# EAGLE design ADDER (EAGLE 9.6.2)
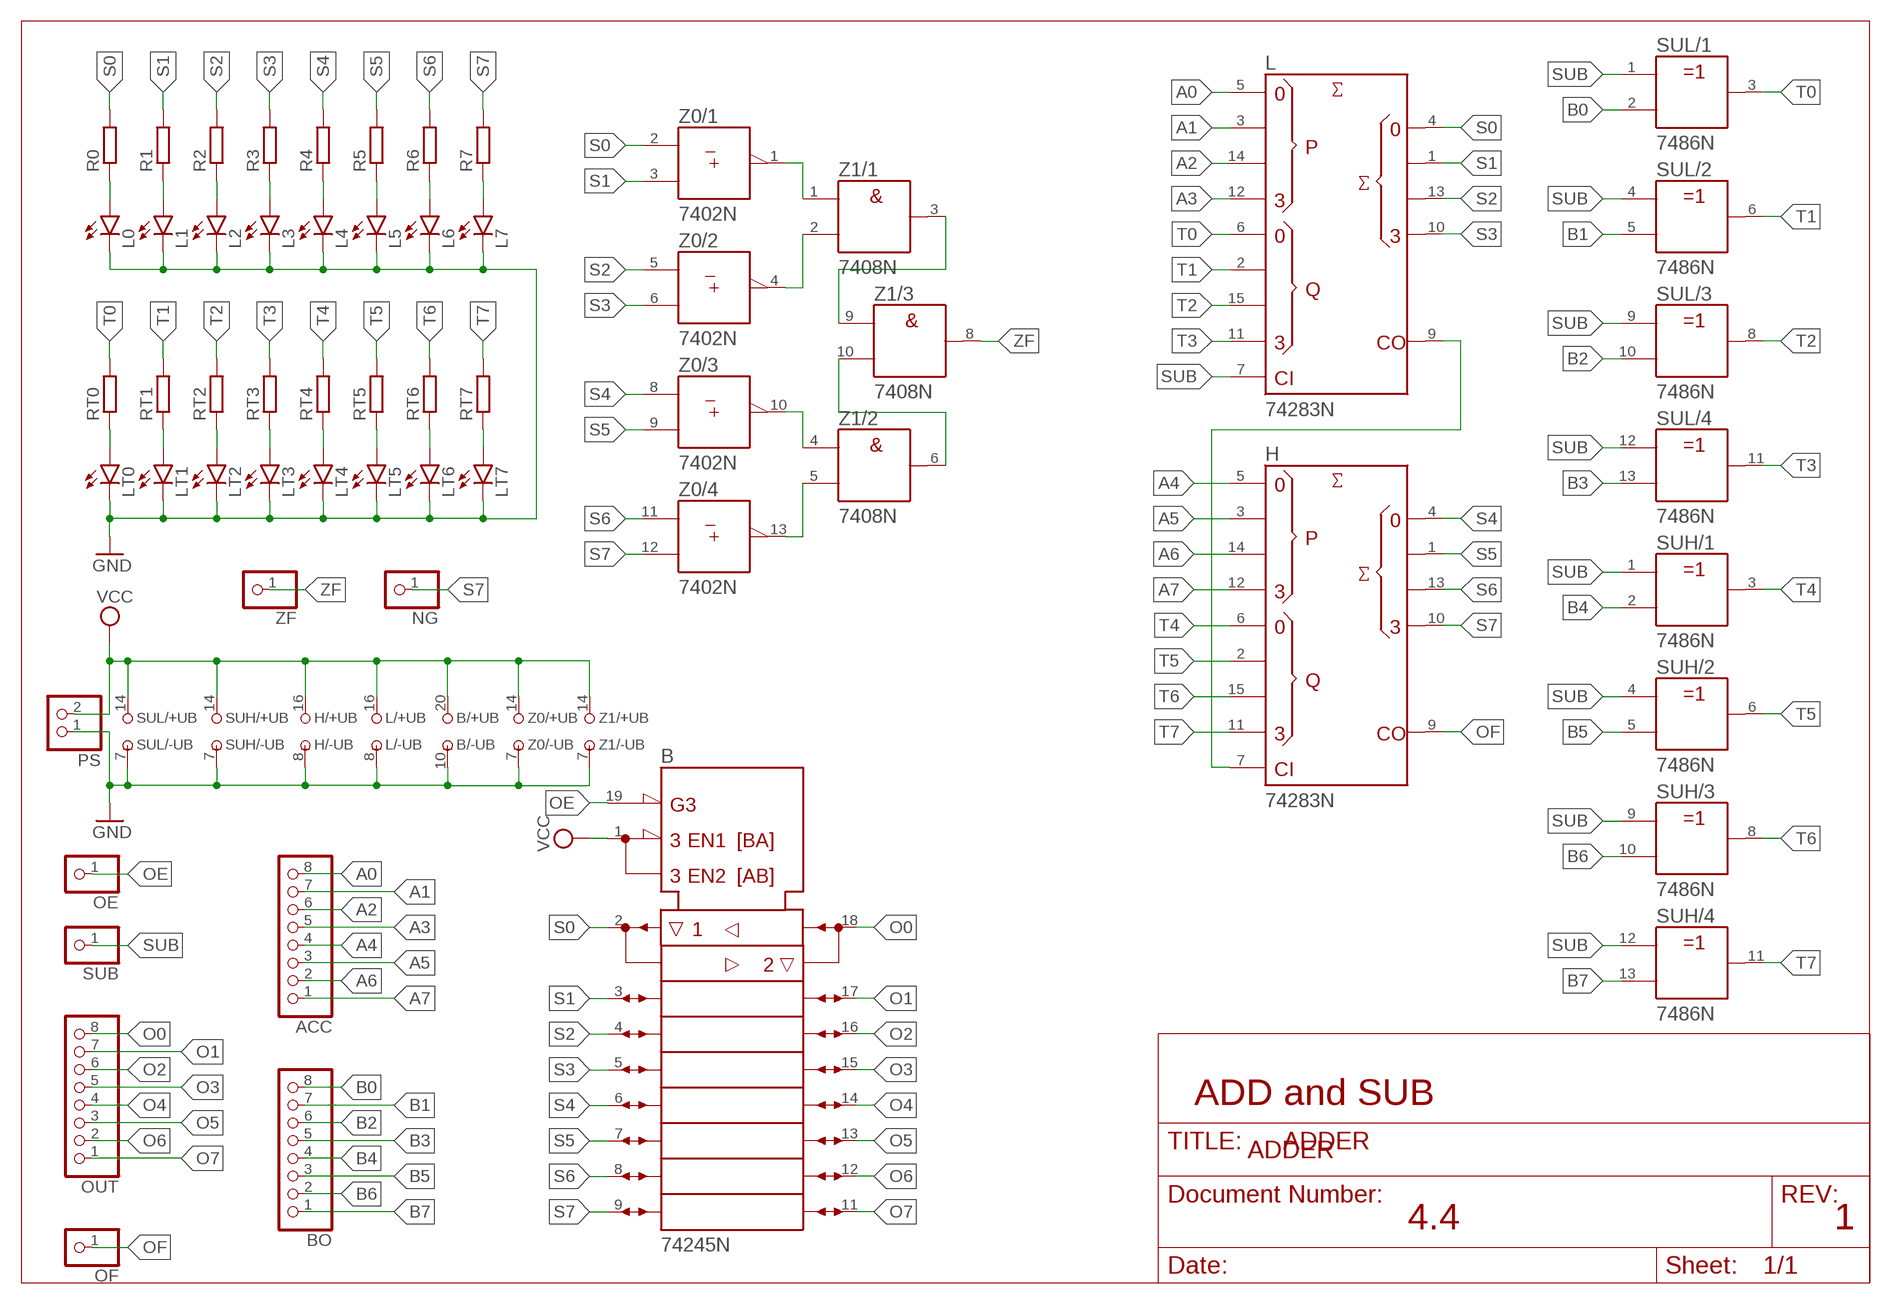
[diagram p0: schematic, sheet 1]

## Parts
ACC  PINHD-1X8  [1X08]
B  74245N  [DIL20]
BO  PINHD-1X8  [1X08]
H  74283N  [DIL16]
L  74283N  [DIL16]
L0  LED5MM  [LED5MM]
L1  LED5MM  [LED5MM]
L2  LED5MM  [LED5MM]
L3  LED5MM  [LED5MM]
L4  LED5MM  [LED5MM]
L5  LED5MM  [LED5MM]
L6  LED5MM  [LED5MM]
L7  LED5MM  [LED5MM]
LT0  LED5MM  [LED5MM]
LT1  LED5MM  [LED5MM]
LT2  LED5MM  [LED5MM]
LT3  LED5MM  [LED5MM]
LT4  LED5MM  [LED5MM]
LT5  LED5MM  [LED5MM]
LT6  LED5MM  [LED5MM]
LT7  LED5MM  [LED5MM]
NG  PINHD-1X1  [1X01]
OE  PINHD-1X1  [1X01]
OF  PINHD-1X1  [1X01]
OUT  PINHD-1X8  [1X08]
PS  PINHD-1X2  [1X02]
R0  R-EU_0204/7  [0204/7]
R1  R-EU_0204/7  [0204/7]
R2  R-EU_0204/7  [0204/7]
R3  R-EU_0204/7  [0204/7]
R4  R-EU_0204/7  [0204/7]
R5  R-EU_0204/7  [0204/7]
R6  R-EU_0204/7  [0204/7]
R7  R-EU_0204/7  [0204/7]
RT0  R-EU_0204/7  [0204/7]
RT1  R-EU_0204/7  [0204/7]
RT2  R-EU_0204/7  [0204/7]
RT3  R-EU_0204/7  [0204/7]
RT4  R-EU_0204/7  [0204/7]
RT5  R-EU_0204/7  [0204/7]
RT6  R-EU_0204/7  [0204/7]
RT7  R-EU_0204/7  [0204/7]
SUB  PINHD-1X1  [1X01]
SUH  7486N  [DIL14]
SUL  7486N  [DIL14]
Z0  7402N  [DIL14]
Z1  7408N  [DIL14]
ZF  PINHD-1X1  [1X01]

## Nets
A0: ACC.8 L.5(A1)
A1: ACC.7 L.3(A2)
A2: ACC.6 L.14(A3)
A3: ACC.5 L.12(A4)
A4: ACC.4 H.5(A1)
A5: ACC.3 H.3(A2)
A6: ACC.2 H.14(A3)
A7: ACC.1 H.12(A4)
B0: BO.8 SUL.2(/1:B)
B1: BO.7 SUL.5(/2:B)
B2: BO.6 SUL.10(/3:B)
B3: BO.5 SUL.13(/4:B)
B4: BO.4 SUH.2(/1:B)
B5: BO.3 SUH.5(/2:B)
B6: BO.2 SUH.10(/3:B)
B7: BO.1 SUH.13(/4:B)
GND: B.10(-UB) H.8(-UB) L0.K(C) L1.K(C) L2.K(C) L3.K(C) L4.K(C) L5.K(C) L6.K(C) L7.K(C) L.8(-UB) LT0.K(C) LT1.K(C) LT2.K(C) LT3.K(C) LT4.K(C) LT5.K(C) LT6.K(C) LT7.K(C) PS.1 SUH.7(/-UB:-UB) SUL.7(/-UB:-UB) Z0.7(/-UB:-UB) Z1.7(/-UB:-UB)
N$1: H.7(C0) L.9(C4)
N$2: L0.A R0.1
N$5: L1.A R1.1
N$7: L2.A R2.1
N$9: L3.A R3.1
N$11: L4.A R4.1
N$13: L5.A R5.1
N$15: L6.A R6.1
N$17: L7.A R7.1
N$18: Z0.13(/4:Y) Z1.5(/2:B)
N$19: LT0.A RT0.1
N$20: Z0.10(/3:Y) Z1.4(/2:A)
N$21: LT1.A RT1.1
N$22: Z1.6(/2:Y) Z1.10(/3:B)
N$23: LT2.A RT2.1
N$25: LT3.A RT3.1
N$26: Z1.3(/1:Y) Z1.9(/3:A)
N$27: LT4.A RT4.1
N$28: Z0.4(/2:Y) Z1.2(/1:B)
N$29: LT5.A RT5.1
N$30: Z0.1(/1:Y) Z1.1(/1:A)
N$31: LT6.A RT6.1
N$33: LT7.A RT7.1
O0: B.18(B1) OUT.8
O1: B.17(B2) OUT.7
O2: B.16(B3) OUT.6
O3: B.15(B4) OUT.5
O4: B.14(B5) OUT.4
O5: B.13(B6) OUT.3
O6: B.12(B7) OUT.2
O7: B.11(B8) OUT.1
OE: B.19(!G) OE.1
OF: H.9(C4) OF.1
S0: B.2(A1) L.4(S1) R0.2 Z0.2(/1:A)
S1: B.3(A2) L.1(S2) R1.2 Z0.3(/1:B)
S2: B.4(A3) L.13(S3) R2.2 Z0.5(/2:A)
S3: B.5(A4) L.10(S4) R3.2 Z0.6(/2:B)
S4: B.6(A5) H.4(S1) R4.2 Z0.8(/3:A)
S5: B.7(A6) H.1(S2) R5.2 Z0.9(/3:B)
S6: B.8(A7) H.13(S3) R6.2 Z0.11(/4:A)
S7: B.9(A8) H.10(S4) NG.1 R7.2 Z0.12(/4:B)
SUB: L.7(C0) SUB.1 SUH.1(/1:A) SUH.4(/2:A) SUH.9(/3:A) SUH.12(/4:A) SUL.1(/1:A) SUL.4(/2:A) SUL.9(/3:A) SUL.12(/4:A)
T0: L.6(B1) RT0.2 SUL.3(/1:Y)
T1: L.2(B2) RT1.2 SUL.6(/2:Y)
T2: L.15(B3) RT2.2 SUL.8(/3:Y)
T3: L.11(B4) RT3.2 SUL.11(/4:Y)
T4: H.6(B1) RT4.2 SUH.3(/1:Y)
T5: H.2(B2) RT5.2 SUH.6(/2:Y)
T6: H.15(B3) RT6.2 SUH.8(/3:Y)
T7: H.11(B4) RT7.2 SUH.11(/4:Y)
VCC: B.1(DIR) B.20(+UB) H.16(+UB) L.16(+UB) PS.2 SUH.14(/+UB:+UB) SUL.14(/+UB:+UB) Z0.14(/+UB:+UB) Z1.14(/+UB:+UB)
ZF: Z1.8(/3:Y) ZF.1
Unconnected: Z1.11(/4:Y) Z1.12(/4:A) Z1.13(/4:B)

## Notes on the sheet
- ADD and SUB
- ADDER
- 4.4 | 1

## Library data of the parts
ACC BO OUT = pinhead:PINHD-1X8: PIN HEADER
B = 74ttl-din:74*245: Octal BUS TRANSCEIVER, 3-state
H L = 74ttl-din:74*283: 4-bit binary FULL ADDER, fast carry
L0 L1-L7 LT0 LT1-LT7 = led:LED: LED OSRAM: - CHIPLED LG R971, LG N971, LY N971, LG Q971, LY Q971, LO R971, LY R971 LH N974, LH R974 LS Q976, LO Q976, LY Q976 LO Q996 - Hyper CHIPLED LW Q18S LB Q993, LB Q99A, LB R99A - SideLED LS A670, LO A670, LY A670, LG A670, LP A670 LB A673, LV A673, LT A673, LW A673 LH A674 LY A675 LS A676, LA A676, LO A676, LY A676, LW A676 LS A679, LY A679, LG A679 - Hyper Micro SIDELED® LS Y876, LA Y876, LO Y876, LY Y876 LT Y87S - SmartLED LW L88C, LW L88S LB L89C, LB L89S, LG L890 LS L89K, LO L89K, LY L89K LS L896, LA L896, LO L896, LY L896 - TOPLED LS T670, LO T670, LY T670, LG T670, LP T670 LSG T670, LSP T670, LSY T670, LOP T670, LYG T670 LG T671, LOG T671, LSG T671 LB T673, LV T673, LT T673, LW T673 LH T674 LS T676, LA T676, LO T676, LY T676, LB T676, LH T676, LSB T676, LW T676 LB T67C, LV T67C, LT T67C, LS T67K, LO T67K, LY T67K, LW E67C LS E67B, LA E67B, LO E67B, LY E67B, LB E67C, LV E67C, LT E67C LW T67C LS T679, LY T679, LG T679 LS T770, LO T770, LY T770, LG T770, LP T770 LB T773, LV T773, LT T773, LW T773 LH T774 LS E675, LA E675, LY E675, LS T675 LS T776, LA T776, LO T776, LY T776, LB T776 LHGB T686 LT T68C, LB T68C - Hyper Mini TOPLED® LB M676 - Mini TOPLED Santana® LG M470 LS M47K, LO M47K, LY M47K Source: http://www.osram.convergy.de LUXEON: - LUMILED® LXK2-PW12-R00, LXK2-PW12-S00, LXK2-PW14-U00, LXK2-PW14-V00 LXK2-PM12-R00, LXK2-PM12-S00, LXK2-PM14-U00 LXK2-PE12-Q00, LXK2-PE12-R00, LXK2-PE12-S00, LXK2-PE14-T00, LXK2-PE14-U00 LXK2-PB12-K00, LXK2-PB12-L00, LXK2-PB12-M00, LXK2-PB14-N00, LXK2-PB14-P00, LXK2-PB14-Q00 LXK2-PR12-L00, LXK2-PR12-M00, LXK2-PR14-Q00, LXK2-PR14-R00 LXK2-PD12-Q00, LXK2-PD12-R00, LXK2-PD12-S00 LXK2-PH12-R00, LXK2-PH12-S00 LXK2-PL12-P00, LXK2-PL12-Q00, LXK2-PL12-R00 Source: www.luxeon.com KINGBRIGHT: KA-3528ASYC Source: www.kingbright.com
NG OE OF SUB ZF = pinhead:PINHD-1X1: PIN HEADER
PS = pinhead:PINHD-1X2: PIN HEADER
R0 R1-R7 RT0 RT1-RT7 = rcl:R-EU_: RESISTOR, European symbol; SPICEPREFIX: R
SUH SUL = 74ttl-din:74*86: Quad 2-input EXCLUSIV-OR gate
Z0 = 74ttl-din:74*02: Quad 2-input NOR gate
Z1 = 74ttl-din:74*08: Quad 2-input AND gate

## Board
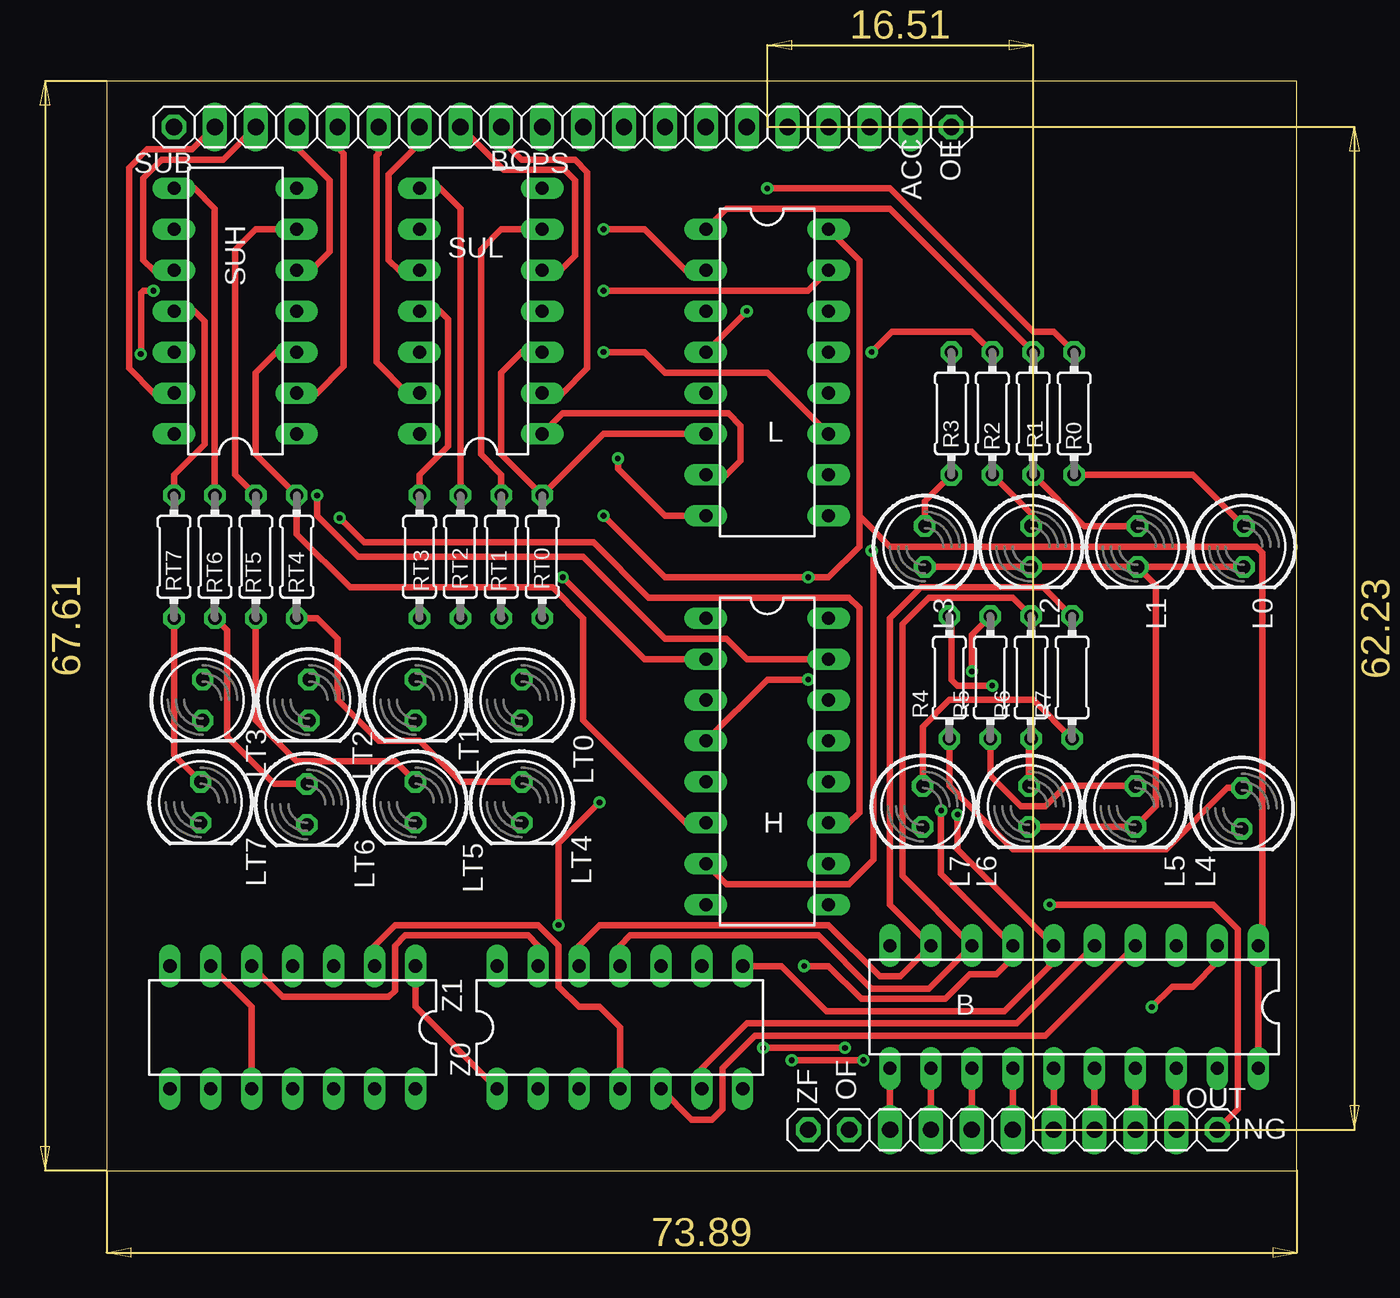
[diagram p1: board, top side]
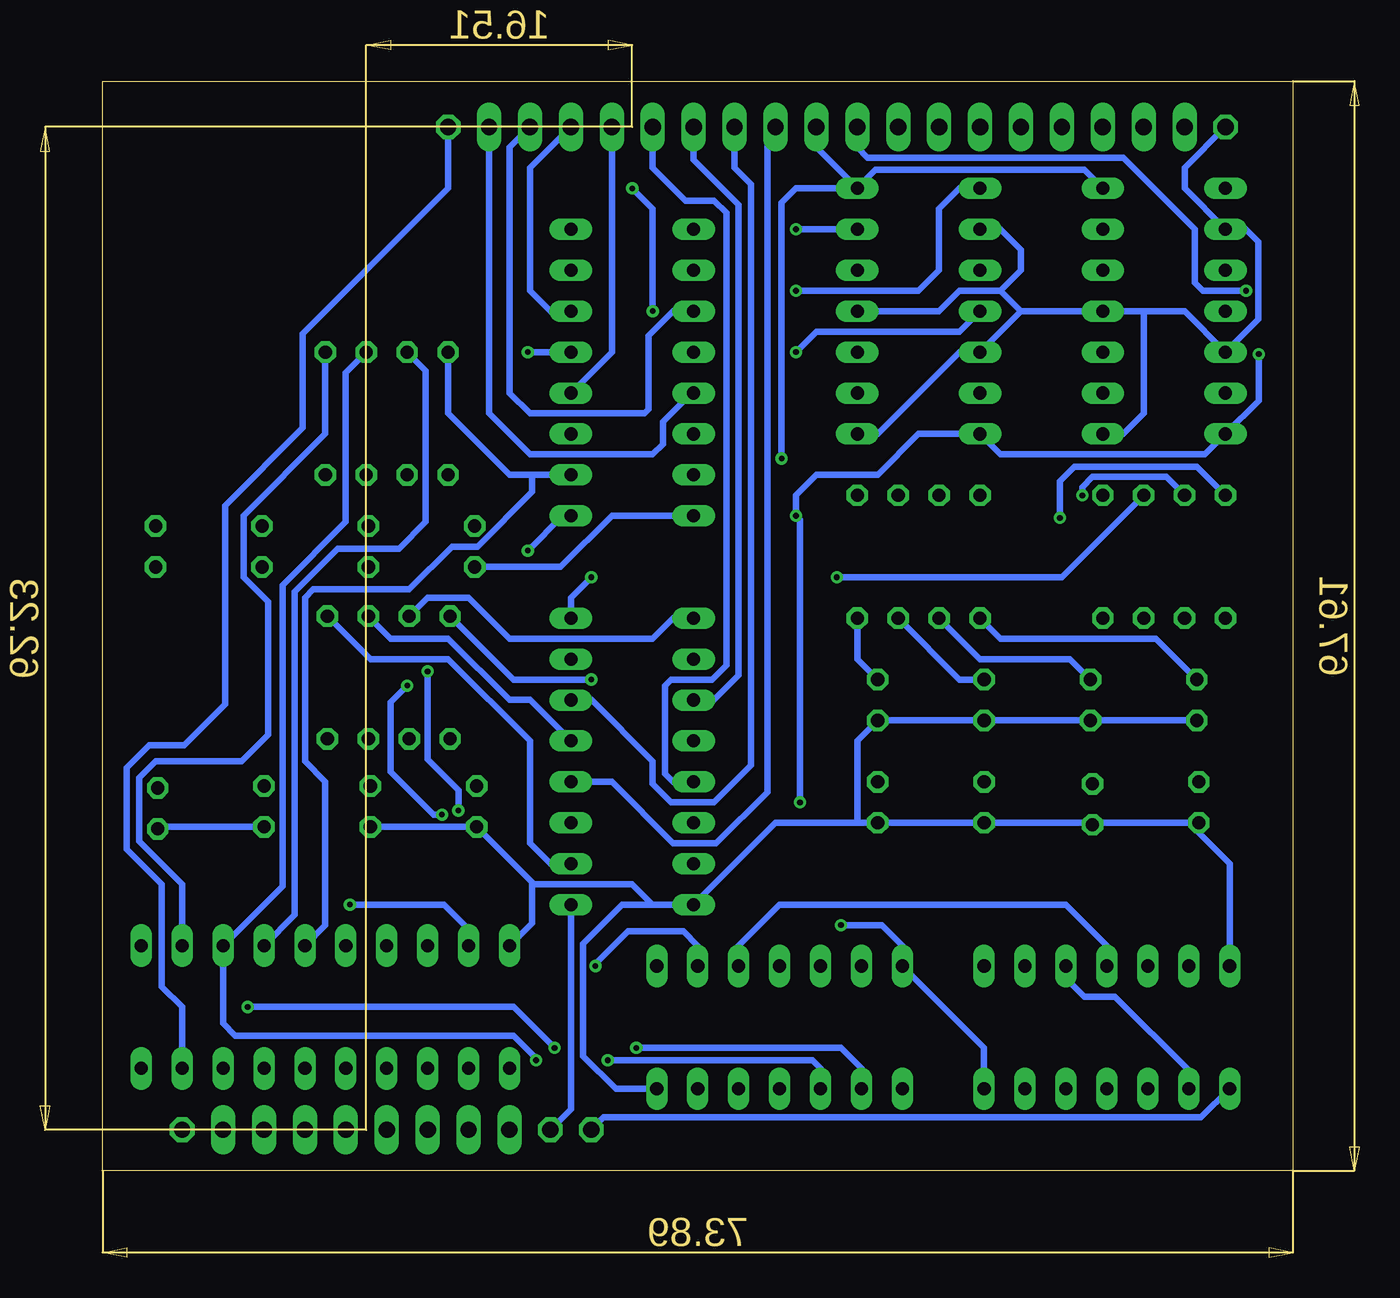
[diagram p2: board, bottom side, seen from below]

Size 73.89 x 67.61 mm. Coordinates in mm from the lower left corner, seen from the top.
Outline: 0,0 73.89,0 73.89,67.61 0,67.61 0,0
Copper layers (1*16): Top 0.035mm / dielectric 1.5mm / Bottom 0.035mm
Design rules "default": minimum track width 6mil, minimum drill 0.35mm, track to track 6mil, track to pad 6mil, pad to pad 6mil, via to via 6mil, smd to smd 6mil, copper to edge 40mil, drill to drill 6mil, minimum pad ring 10mil, minimum via ring 8mil, stop-mask expansion 4mil, vias tented up to drill 0mil, thermal gap 10mil

### Footprints (pad centres in the part's own frame; a part is rotated, then mirrored left to right if it is on the bottom)
1X08 = drill 1.016 long: 1 -8.89,0; 2 -6.35,0; 3 -3.81,0; 4 -1.27,0; 5 1.27,0; 6 3.81,0; 7 6.35,0; 8 8.89,0
DIL20 = drill 0.813 long: 1 -11.43,-3.81; 2 -8.89,-3.81; 3 -6.35,-3.81; 4 -3.81,-3.81; 5 -1.27,-3.81; 6 1.27,-3.81; 7 3.81,-3.81; 8 6.35,-3.81; 9 8.89,-3.81; 10 11.43,-3.81; 11 11.43,3.81; 12 8.89,3.81; 13 6.35,3.81; 14 3.81,3.81; 15 1.27,3.81; 16 -1.27,3.81; 17 -3.81,3.81; 18 -6.35,3.81; 19 -8.89,3.81; 20 -11.43,3.81
DIL16 = drill 0.813 long: 1 -8.89,-3.81; 2 -6.35,-3.81; 3 -3.81,-3.81; 4 -1.27,-3.81; 5 1.27,-3.81; 6 3.81,-3.81; 7 6.35,-3.81; 8 8.89,-3.81; 9 8.89,3.81; 10 6.35,3.81; 11 3.81,3.81; 12 1.27,3.81; 13 -1.27,3.81; 14 -3.81,3.81; 15 -6.35,3.81; 16 -8.89,3.81
LED5MM = drill 0.813 octagon: A -1.27,0; K 1.27,0
1X01 = drill 1.016 octagon: 1 0,0
1X02 = drill 1.016 long: 1 -1.27,0; 2 1.27,0
0204/7 = drill 0.813 octagon: 1 -3.81,0; 2 3.81,0
DIL14 = drill 0.813 long: 1 -7.62,-3.81; 2 -5.08,-3.81; 3 -2.54,-3.81; 4 0,-3.81; 5 2.54,-3.81; 6 5.08,-3.81; 7 7.62,-3.81; 8 7.62,3.81; 9 5.08,3.81; 10 2.54,3.81; 11 0,3.81; 12 -2.54,3.81; 13 -5.08,3.81; 14 -7.62,3.81

### Placement (x,y rotation side)
ACC  41.02,64.77 0 top
B  60.07,10.16 180 top
BO  15.62,64.77 0 top
H  41.02,25.4 270 top
L  41.02,49.53 270 top
L0  70.61,38.73 270 top
L1  64.01,38.73 270 top
L2  57.4,38.73 270 top
L3  50.8,38.73 270 top
L4  70.48,22.48 270 top
L5  63.88,22.61 270 top
L6  57.28,22.61 270 top
L7  50.67,22.61 270 top
LT0  25.78,29.21 270 top
LT1  19.18,29.21 270 top
LT2  12.57,29.21 270 top
LT3  5.97,29.21 270 top
LT4  25.78,22.86 270 top
LT5  19.18,22.86 270 top
LT6  12.45,22.73 270 top
LT7  5.84,22.86 270 top
NG  68.96,2.54 0 top
OE  52.45,64.77 0 top
OF  46.1,2.54 0 top
OUT  57.53,2.54 0 top
PS  28.32,64.77 180 top
R0  60.07,46.99 90 top
R1  57.53,46.99 90 top
R2  54.99,46.99 90 top
R3  52.45,46.99 90 top
R4  52.32,30.61 90 top
R5  54.86,30.61 90 top
R6  57.4,30.61 90 top
R7  59.94,30.61 90 top
RT0  27.05,38.1 90 top
RT1  24.51,38.1 90 top
RT2  21.97,38.1 90 top
RT3  19.43,38.1 90 top
RT4  11.81,38.1 90 top
RT5  9.27,38.1 90 top
RT6  6.73,38.1 90 top
RT7  4.19,38.1 90 top
SUB  4.19,64.77 0 top
SUH  8,53.34 90 top
SUL  23.24,53.34 90 top
Z0  31.88,8.89 0 top
Z1  11.56,8.89 180 top
ZF  43.56,2.54 90 top

### Tracks (layer width: path | path; a pad name or v marks a point on that pad's centre or on a via)
A0
  Bottom 0.4: ACC.8 49.91,46.99 47.37,44.45 39.75,44.45 39.12,45.09 39.12,46.48 37.34,48.26 L.5
A1
  Bottom 0.4: L.3 38.48,53.34 40.01,51.82 40.01,47.24 40.26,46.99 47.37,46.99 48.64,48.26 48.64,63.5 ACC.7
A2
  Bottom 0.4: ACC.6 47.37,62.23 47.37,54.61 46.1,53.34 L.14
A3
  Bottom 0.4: L.12 42.29,50.8 ACC.5
A4
  Bottom 0.4: ACC.4 39.75,62.23 37.72,60.2 35.94,60.2 35.18,59.44 35.18,31.37 36.07,30.48 38.61,30.48 38.99,30.1 38.99,24.64 38.48,24.13 H.5
A5
  Bottom 0.4: H.3 35.94,29.21 34.42,30.73 34.42,59.94 37.21,62.74 ACC.3
A6
  Bottom 0.4: H.14 43.56,29.21 39.75,25.4 39.75,24 38.61,22.86 35.94,22.86 33.66,25.15 33.66,61.21 34.67,62.23 ACC.2
A7
  Bottom 0.4: ACC.1 32.64,64.26 32.64,23.5 35.81,20.32 38.48,20.32 42.29,24.13 H.12
B0
  Top 0.4: SUL.2 28.32,48.26 29.84,49.78 29.84,61.98 29.08,62.74 25.78,62.74 24.51,64.01 BO.8
B1
  Top 0.4: SUL.5 28.19,55.88 29.08,56.77 29.08,61.47 28.45,62.1 24.64,62.1 BO.7
B2
  Top 0.4: SUL.10 18.16,55.88 17.53,56.52 17.53,61.85 19.43,63.75 BO.6
B3
  Top 0.4: BO.5 16.89,63.12 16.76,62.99 16.76,50.16 18.67,48.26 SUL.13
B4
  Top 0.4: SUH.2 13.08,48.26 14.73,49.91 14.73,63.12 14.35,63.5 BO.4
B5
  Top 0.4: SUH.5 12.7,55.88 13.84,57.02 13.84,61.47 11.81,63.5 BO.3
B6
  Top 0.4: SUH.10 2.92,55.88 2.29,56.52 2.29,61.59 3.43,62.74 7.24,62.74 BO.2
B7
  Top 0.4: SUH.13 2.92,48.26 1.4,49.78 1.4,62.23 2.54,63.37 5.33,63.37 BO.1
GND  (via drill 0.35)
  Top 0.4: L3.K L2.K L1.K | L1.K L0.K | L1.K 65.15,36.32 65.15,22.61 L5.K L6.K | L.8 34.67,40.64 31.75,43.56 v31.75,44.2
  Bottom 0.4: LT3.K LT2.K LT1.K LT0.K 27.05,26.67 27.05,21.59 | LT7.K 6.48,21.59 | 6.48,21.59 12.32,21.59 LT6.K 12.57,21.59 LT5.K LT4.K 27.05,21.59 | SUL.7 29.59,63.5 PS.1 | SUH.7 12.95,62.1 25.91,62.1 SUL.7 | L6.K L7.K 47.24,17.91 | L5.K 70.36,21.34 L4.K | 39.75,16.51 H.8 32.13,21.59 27.05,21.59 | 39.75,16.51 41.02,17.78 47.12,17.78 47.24,17.91 | v31.75,44.2 31.75,60.07 30.86,60.96 SUL.7 | L3.K 45.47,37.47 42.29,40.64 L.8 | B.10 47.24,15.37 47.24,17.91 | Z1.7 3.94,19.05 6.48,21.59 | Z0.7 42.04,5.08 44.07,7.11 44.07,14.1 41.66,16.51 39.75,16.51
N$1  (via drill 0.35)
  Top 0.4: H.7 38.48,17.78 46.1,17.78 47.62,19.3 47.62,38.35 v47.5,38.48
  Bottom 0.4: v47.5,38.48 45.34,40.64 L.9
N$2
  Top 0.4: R0.1 67.44,43.18 L0.A
N$5
  Top 0.4: R1.1 60.71,40.01 L1.A
N$7
  Top 0.4: R2.1 57.4,40.77 L2.A
N$9
  Top 0.4: L3.A 50.8,41.53 R3.1
N$11
  Top 0.4: L4.A 69.6,23.75 65.79,19.94 56.26,19.94 52.32,23.88 R4.1
N$13
  Top 0.4: L5.A 59.56,23.88 58.29,22.61 56.77,22.61 54.86,24.51 R5.1
N$15
  Top 0.4: L6.A 57.28,26.67 R6.1
N$17
  Top 0.4: L7.A 50.67,27.56 52.32,29.21 57.53,29.21 R7.1
N$18
  Top 0.4: Z0.13 26.8,13.97 26.16,14.61 18.54,14.61 17.91,13.97 17.91,11.18 17.53,10.79 10.92,10.79 Z1.5
N$19
  Bottom 0.4: LT0.A 27.05,31.75 RT0.1
N$20
  Bottom 0.4: Z0.10 34.42,13.97 31.88,16.51 14.1,16.51 11.56,13.97 Z1.4
N$21
  Bottom 0.4: LT1.A 20.7,30.48 RT1.1
N$22
  Top 0.4: Z1.10 9.02,10.16 Z1.6
N$23
  Bottom 0.4: LT2.A 13.84,31.75 19.43,31.75 RT2.1
N$25
  Bottom 0.4: LT3.A 8.51,33.02 18.16,33.02 RT3.1
N$26
  Bottom 0.4: Z1.9 6.48,6.22 11.05,10.79 12.95,10.79 14.1,11.94 Z1.3
N$27
  Top 0.4: LT4.A 21.97,24.13 19.43,26.67 16.89,26.67 14.35,29.21 14.35,33.02 13.08,34.29 RT4.1
N$28
  Top 0.4: Z0.4 31.88,8.89 30.61,10.16 29.34,10.16 28.07,11.43 28.07,13.97 26.8,15.24 17.91,15.24 16.64,13.97 Z1.2
N$29
  Top 0.4: LT5.A 17.91,25.4 11.81,25.4 9.27,27.94 RT5.1
N$30
  Top 0.4: Z0.1 19.18,10.16 Z1.1
N$31
  Top 0.4: RT6.1 7.49,33.53 7.49,26.92 10.41,24 LT6.A
N$33
  Top 0.4: LT7.A 4.19,25.78 RT7.1
O0
  Top 0.4: B.18 OUT.8
O1
  Top 0.4: OUT.7 B.17
O2
  Top 0.4: B.16 OUT.6
O3
  Top 0.4: OUT.5 B.15
O4
  Top 0.4: B.14 OUT.4
O5
  Top 0.4: OUT.3 B.13
O6
  Top 0.4: B.12 OUT.2
O7
  Top 0.4: OUT.1 B.11
OE
  Bottom 0.4: B.19 68.96,10.16 70.23,11.43 70.23,17.78 72.39,19.94 72.39,25.02 70.99,26.42 68.83,26.42 66.29,28.96 66.29,41.27 61.47,46.1 61.47,51.94 52.45,60.96 OE.1
OF
  Bottom 0.4: OF.1 44.83,3.81 H.9
S0  (via drill 0.35)
  Top 0.4: L.4 v39.75,53.34 | v41.02,60.96 48.64,60.96 57.53,52.07 58.8,52.07 R0.2 | v40.77,7.62 v45.85,7.62 | v64.9,10.16 66.17,11.43 67.44,11.43 68.96,12.95 B.2
  Bottom 0.4: v39.75,53.34 39.75,59.69 v41.02,60.96 | B.2 68.96,17.78 71.63,20.45 71.63,24.38 70.61,25.4 65.28,25.4 63.63,27.05 63.63,35.31 65.15,36.83 65.15,40.64 60.07,45.72 R0.2 | Z0.2 26.8,6.35 28.07,7.62 v40.77,7.62 | v45.85,7.62 48.39,10.16 v64.9,10.16
S1  (via drill 0.35)
  Top 0.4: R1.2 48.64,59.69 38.48,59.69 L.1 | v42.55,6.86 v46.99,6.86
  Bottom 0.4: R1.2 58.8,49.53 58.8,40.26 62.74,36.32 62.74,17.65 B.3 66.42,9.14 65.66,8.38 48.39,8.38 46.99,6.99 v46.99,6.86 | Z0.3 29.34,6.35 29.84,6.86 v42.55,6.86
S2  (via drill 0.35)
  Top 0.4: v47.5,50.8 48.77,52.07 53.72,52.07 R2.2 | B.4 58.29,8.38 40.26,8.38 38.23,6.35 38.23,3.81 37.59,3.17 36.32,3.17 Z0.5
  Bottom 0.4: L.13 v47.5,50.8 | R2.2 53.85,49.66 53.85,40.26 55.5,38.61 59.31,38.61 61.98,35.94 61.98,15.88 B.4
S3
  Top 0.4: Z0.6 36.96,6.35 39.75,9.14 56.52,9.14 B.5
  Bottom 0.4: L.10 47.24,43.18 | 47.24,43.18 48.64,43.18 52.45,46.99 R3.2 | B.5 60.07,15.24 60.07,24.13 61.34,25.4 61.34,35.56 60.83,36.07 54.86,36.07 52.2,38.73 50.64,38.73 47.24,42.13 47.24,43.18
S4  (via drill 0.35)
  Top 0.4: H.4 41.02,30.48 v43.56,30.48 | R4.2 52.45,34.29 52.45,30.48 52.83,30.1 v54.99,30.1 | v52.83,22.1 52.83,19.94 B.6 58.55,13.72 58.55,12.7 55.75,9.91 44.7,9.91 41.91,12.7 Z0.8
  Bottom 0.4: R4.2 48.39,30.48 v43.56,30.48 | v54.99,30.1 56.01,29.08 56.01,24.77 53.34,22.1 v52.83,22.1
S5  (via drill 0.35)
  Top 0.4: v51.82,22.35 51.82,18.41 B.7 56.26,13.21 55.24,12.19 53.59,12.19 52.07,10.67 46.86,10.67 44.83,12.7 v43.31,12.7 | R5.2 53.72,33.27 v53.72,30.99
  Bottom 0.4: H.1 38.48,34.29 39.75,33.02 48.64,33.02 51.18,35.56 53.72,35.56 R5.2 | v51.82,22.35 51.82,23.62 53.72,25.53 v53.72,30.99 | Z0.9 36.96,13.97 37.85,14.86 41.27,14.86 43.31,12.83 v43.31,12.7
S6
  Top 0.4: R6.2 56.26,35.56 51.05,35.56 49.4,33.91 49.4,18.29 B.8 51.05,11.3 47.5,11.3 44.2,14.61 32.51,14.61 31.88,13.97 Z0.11
  Bottom 0.4: H.13 47.37,29.21 48.64,29.21 52.45,33.02 56.01,33.02 R6.2
S7  (via drill 0.35)
  Top 0.4: R7.2 58.17,36.2 50.55,36.2 48.64,34.29 48.64,16.51 B.9 49.28,12.06 48.01,12.06 44.83,15.24 30.61,15.24 29.34,13.97 Z0.12 | NG.1 70.23,3.81 70.23,14.99 68.71,16.51 v58.55,16.51
  Bottom 0.4: R7.2 57.28,31.75 52.45,31.75 47.37,26.67 47.37,20.32 46.1,19.05 H.10 | B.9 51.18,14.99 52.7,16.51 v58.55,16.51
SUB
  Top 0.4: L.7 38.48,43.18 39.37,44.07 39.37,46.23 38.61,46.99 28.32,46.99 SUL.1
  Bottom 0.4: 9.27,53.34 6.73,53.34 SUH.12 2.16,52.83 2.16,57.66 2.92,58.42 SUH.9 6.73,60.96 6.73,62.23 SUB.1 | 9.27,53.34 SUH.4 16.89,53.34 | SUH.1 10.54,45.72 9.27,46.99 9.27,53.34 | 16.89,53.34 SUL.12 20.7,50.8 25.78,45.72 SUL.1 | SUL.4 21.97,53.34 20.7,54.61 18.16,54.61 | 16.89,53.34 18.16,54.61 | 18.16,54.61 16.89,55.88 16.89,57.15 18.16,58.42 SUL.9
T0
  Top 0.4: SUL.3 25.78,50.8 24.51,49.53 24.51,44.45 RT0.2 30.86,45.72 L.6
T1  (via drill 0.35)
  Top 0.4: RT1.2 24.51,43.18 23.24,44.45 23.24,57.15 24.51,58.42 SUL.6 | v30.86,58.42 33.4,58.42 35.94,55.88 L.2
  Bottom 0.4: SUL.6 v30.86,58.42
T2  (via drill 0.35)
  Top 0.4: RT2.2 21.97,59.69 20.7,60.96 SUL.8 | L.15 43.56,54.61 v30.86,54.61
  Bottom 0.4: SUL.8 20.7,60.96 21.97,59.69 21.97,55.88 23.24,54.61 v30.86,54.61
T3  (via drill 0.35)
  Top 0.4: RT3.2 19.43,43.18 21.21,44.96 21.21,52.83 20.7,53.34 SUL.11 | v30.86,50.8 33.4,50.8 34.67,49.53 41.02,49.53 L.11
  Bottom 0.4: SUL.11 20.7,52.07 29.59,52.07 v30.86,50.8
T4
  Top 0.4: SUH.3 10.54,50.8 9.27,49.53 9.27,44.45 RT4.2 11.81,39.5 15.11,36.2 27.69,36.2 29.59,34.29 29.59,27.94 35.94,21.59 H.6
T5  (via drill 0.35)
  Top 0.4: RT5.2 8,43.18 8,57.15 9.27,58.42 SUH.6 | v28.32,36.83 33.4,31.75 H.2
  Bottom 0.4: RT5.2 14.35,36.83 v28.32,36.83
T6  (via drill 0.35)
  Top 0.4: SUH.8 5.46,60.96 6.73,59.69 RT6.2 | H.15 39.75,31.75 38.48,33.02 34.67,33.02 29.59,38.1 15.62,38.1 13.08,40.64 v13.08,41.91
  Bottom 0.4: v13.08,41.91 13.08,42.42 12.45,43.05 7.87,43.05 RT6.2
T7  (via drill 0.35)
  Top 0.4: RT7.2 4.19,43.18 6.1,45.09 6.1,52.7 5.46,53.34 SUH.11 | v14.48,40.51 16,38.99 30.23,38.99 33.66,35.56 46.1,35.56 46.74,34.92 46.74,22.23 46.1,21.59 H.11
  Bottom 0.4: RT7.2 5.97,43.69 13.59,43.69 14.48,42.8 v14.48,40.51
VCC  (via drill 0.35)
  Top 0.4: v30.86,40.64 34.67,36.83 v43.56,36.83 44.83,36.83 46.74,38.73 46.74,40.64 | L.16 46.74,56.52 46.74,40.64 | v2.92,54.61 2.29,54.61 2.16,54.48 2.16,50.67 v2.13,50.67 | 46.74,40.64 48.64,38.73 71.37,38.73 71.75,38.35 71.75,14.22 B.1 B.20 | v30.61,22.86 28.07,20.32 v28.07,15.24
  Bottom 0.4: PS.2 27.05,63.5 26.42,62.87 10.54,62.87 6.1,58.42 6.1,55.12 5.59,54.61 v2.92,54.61 | v43.56,36.83 44.83,35.56 H.16 | v2.13,50.67 2.13,47.78 SUH.14 5.46,44.45 18.16,44.45 SUL.14 23.24,45.72 25.78,43.18 29.59,43.18 30.86,41.91 v30.86,40.64 30.61,40.39 v30.61,22.86 | Z1.14 19.18,7.62 Z0.14 24.26,13.97 25.53,15.24 v28.07,15.24
ZF
  Bottom 0.4: Z1.8 5.71,3.3 42.8,3.3 ZF.1